# EAGLE schematic HBridge (EAGLE 7.3.0)
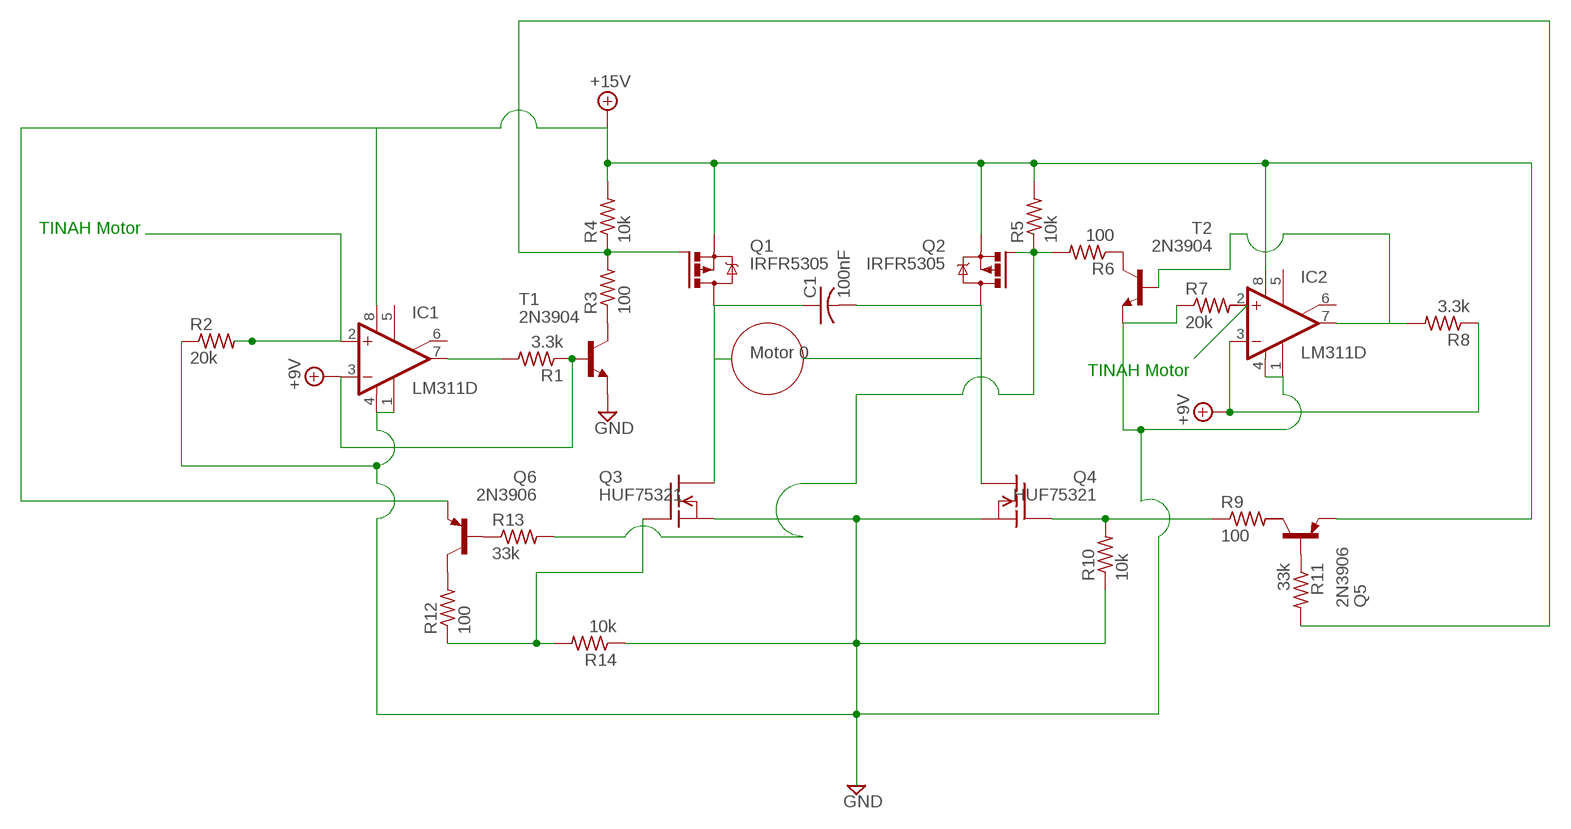
[diagram p0: schematic, sheet 1]

## Parts
C1  100nF  C-US025-024X044  [C025-024X044]
IC1  LM311D  [SO08]
IC2  LM311D  [SO08]
Q1  IRFR5305  [D-PAK_TO252AA]
Q2  IRFR5305  [D-PAK_TO252AA]
Q3  HUF75321  FDS5680  [SO-8]
Q4  HUF75321  FDS5680  [SO-8]
Q5  2N3906  [TO92]
Q6  2N3906  [TO92]
R1  3.3k  R-US_0204/2V  [0204V]
R2  20k  R-US_0204/2V  [0204V]
R3  100  R-US_0204/2V  [0204V]
R4  10k  R-US_0204/2V  [0204V]
R5  10k  R-US_0204/2V  [0204V]
R6  100  R-US_0204/2V  [0204V]
R7  20k  R-US_0204/2V  [0204V]
R8  3.3k  R-US_0204/2V  [0204V]
R9  100  R-US_0204/2V  [0204V]
R10  10k  R-US_0204/2V  [0204V]
R11  33k  R-US_0204/2V  [0204V]
R12  100  R-US_0204/2V  [0204V]
R13  33k  R-US_0204/2V  [0204V]
R14  10k  R-US_0204/2V  [0204V]
T1  2N3904  [TO92]
T2  2N3904  [TO92]

## Nets
+5V: IC1.3(-IN) IC2.3(-IN) R1.1 R8.1 T1.2(B) ; supply symbol labelled +9V
+15V: IC1.8(V+) IC2.8(V+) Q1.3(S) Q2.3(S) Q5.3(E) Q6.3(E) R4.2 R5.2
GND: T1.3(E)
N$1: IC1.7(OUT) R1.2
N$2: IC1.2(+IN) R2.2
N$3: R3.1 T1.1(C)
N$4: Q2.1(G) R5.1 R6.2 R13.2
N$5: IC1.1(GND) IC1.4(V-) IC2.1(GND) IC2.4(V-) Q3.1(S) Q3.2(S) Q3.3(S) Q4.1(S) Q4.2(S) Q4.3(S) R2.1 R7.1 R10.1 R14.1 T2.3(E)
N$6: C1.2 Q2.4(D) Q4.5(D) Q4.6(D) Q4.7(D) Q4.8(D)
N$7: C1.1 Q1.4(D) Q3.5(D) Q3.6(D) Q3.7(D) Q3.8(D)
N$8: R6.1 T2.1(C)
N$9: Q4.4(G) R9.1 R10.2
N$10: R7.2
N$11: IC2.7(OUT) R8.2 T2.2(B)
N$12: Q1.1(G) R3.2 R4.1 R11.2
N$13: Q5.2(B) R11.1
N$14: Q6.1(C) R12.2
N$15: Q6.2(B) R13.1
N$16: Q3.4(G) R12.1 R14.2
Unconnected: IC1.5(ON) IC1.6(ON/STR) IC2.2(+IN) IC2.5(ON) IC2.6(ON/STR) Q5.1(C) R9.2

## Notes on the sheet
- TINAH Motor
- Motor 0
- TINAH Motor

## Library data of the parts
C1 = resistor:C-US: CAPACITOR, American symbol
IC1 IC2 = linear:LM311: COMPARATOR
Q1 Q2 = transistor-power:IRF?5305: HEXFET Power MOSFET Source: http://www.irf.com/product-info/datasheets/data/irfr5305pbf.pdf
Q3 Q4 = transistor-fet:FDS5680: 60V N-Channel PowerTrench TM MOSFET FAIRCHILD FDS5680.pdf
Q5 Q6 = transistor-pnp:2N3906: PNP Transistor
R1-R14 = resistor:R-US_: RESISTOR, American symbol
T1 T2 = transistor:2N3904: NPN TRANSISTOR